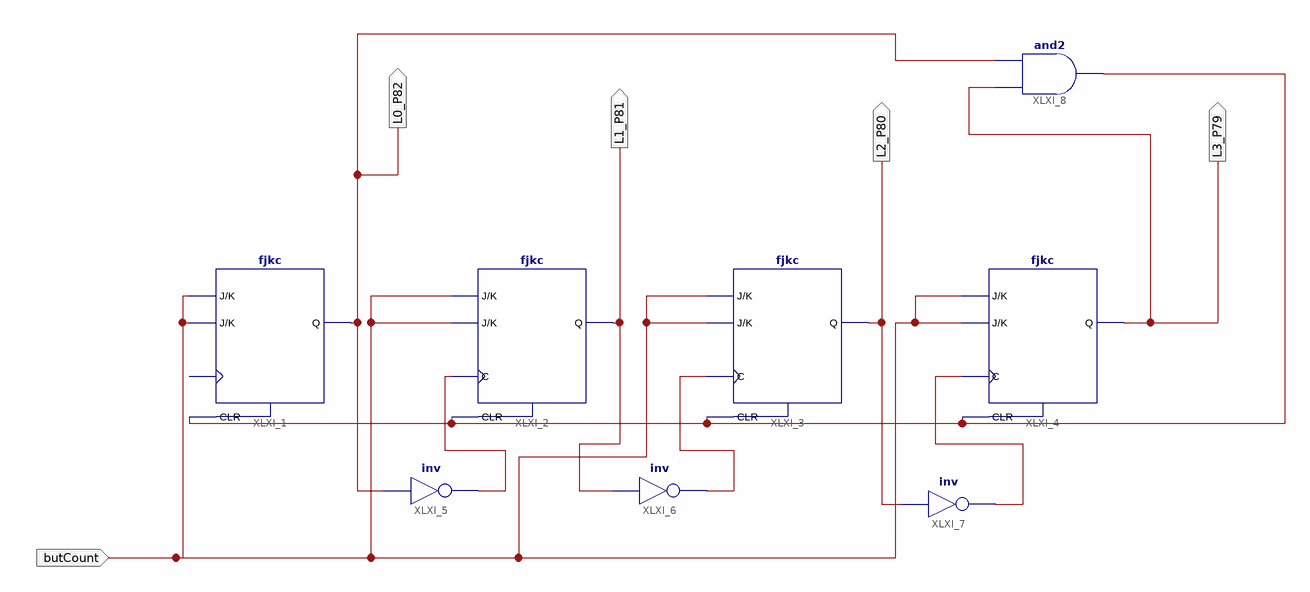
[diagram p0: schematic sheet 1]
// Xilinx ISE schematic mod9.sch (spartan6) as structural Verilog: 8 symbols, 5 ports
module mod9 (
  input  butCount,
  output L1_P81,
  output L2_P80,
  output L3_P79,
  output L0_P82
);

  wire XLXN_3, XLXN_5, XLXN_7, XLXN_13;

  fjkc XLXI_1 (.CLR(XLXN_13), .J(butCount), .K(butCount), .Q(L0_P82));  // open: C
  fjkc XLXI_2 (.C(XLXN_3), .CLR(XLXN_13), .J(butCount), .K(butCount), .Q(L1_P81));
  fjkc XLXI_3 (.C(XLXN_5), .CLR(XLXN_13), .J(butCount), .K(butCount), .Q(L2_P80));
  fjkc XLXI_4 (.C(XLXN_7), .CLR(XLXN_13), .J(butCount), .K(butCount), .Q(L3_P79));
  not XLXI_5 (XLXN_3, L0_P82);
  not XLXI_6 (XLXN_5, L1_P81);
  not XLXI_7 (XLXN_7, L2_P80);
  and XLXI_8 (XLXN_13, L3_P79, L0_P82);
endmodule
